# EAGLE design bbb_d300_breakout (EAGLE 7.7.0)

## Sheet 1 of 2
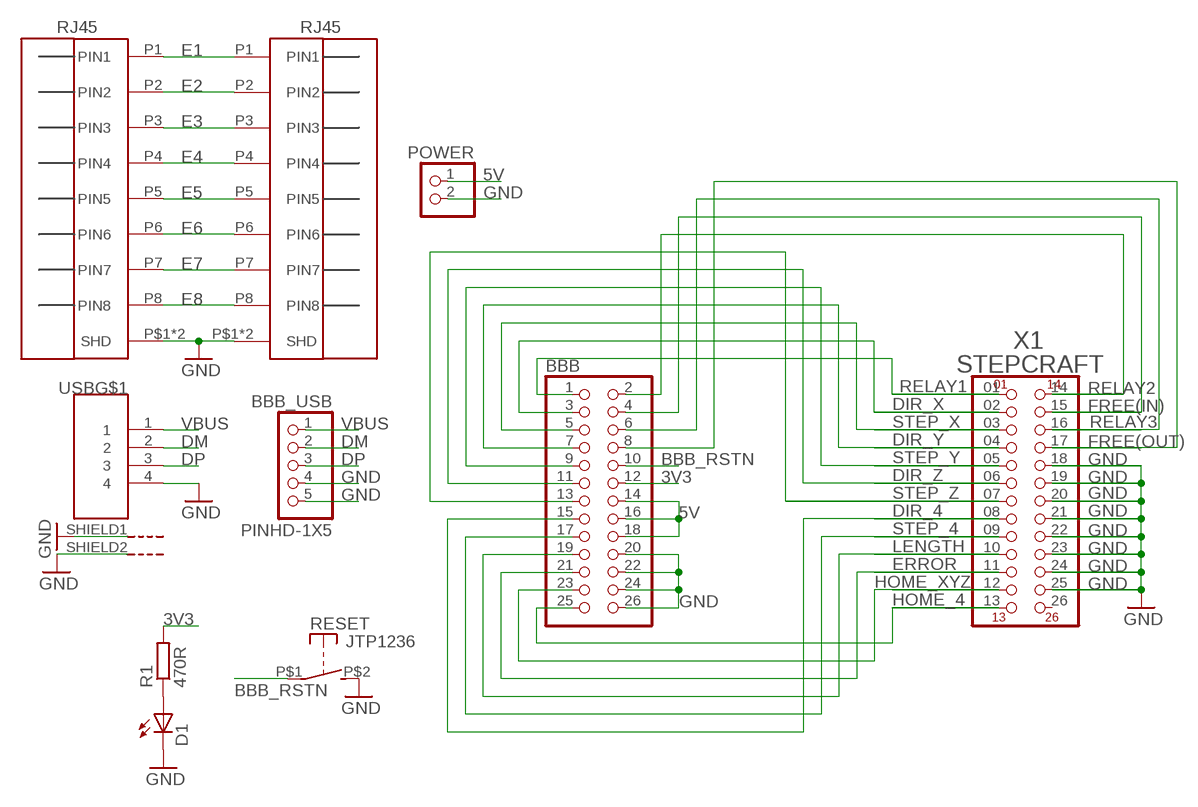
[diagram p0: schematic, sheet 1]

### Parts
BBB  PINHD-2X13  [2X13]
BBB_USB  PINHD-1X5  [1X05_XXL]
D1  LEDXXL  [LED3MM_XXL]
POWER  PINHD-1X2  [1X02]
R1  470R  R-EU_R0805  [R0805]
RESET  JTP1236  [JTP1236]
USB  USB_HOST  [USB]
X1  STEPCRAFT  PINHD-2X13_STEPCRAFT  [2X13_90_STEPCRAFT]
X2  RJ45  [RJ45]
X3  RJ45  [RJ45]

### Nets
3V3: BBB.12 R1.2
5V: BBB.14 BBB.16 BBB.18 POWER.1
BBB_RSTN: BBB.10 RESET.P$1(P)
DIR_4: BBB.15 X1.08
DIR_X: BBB.3 X1.02
DIR_Y: BBB.7 X1.04
DIR_Z: BBB.11 X1.06
DM: BBB_USB.2 USB.2
DP: BBB_USB.3 USB.3
E1: X2.P1(PIN1) X3.P1(PIN1)
E2: X2.P2(PIN2) X3.P2(PIN2)
E3: X2.P3(PIN3) X3.P3(PIN3)
E4: X2.P4(PIN4) X3.P4(PIN4)
E5: X2.P5(PIN5) X3.P5(PIN5)
E6: X2.P6(PIN6) X3.P6(PIN6)
E7: X2.P7(PIN7) X3.P7(PIN7)
E8: X2.P8(PIN8) X3.P8(PIN8)
ERROR: BBB.21 X1.11
FREE(IN): BBB.4 X1.15
FREE(OUT): BBB.8 X1.17
GND: BBB.20 BBB.22 BBB.24 BBB.26 BBB_USB.4 BBB_USB.5 D1.K(C) POWER.2 RESET.P$2(S) USB.4 USB.SHIELD1(G) USB.SHIELD2(G) X1.18 X1.19 X1.20 X1.21 X1.22 X1.23 X1.24 X1.25 X2.P$1(SHD) X2.P$2(SHD) X3.P$1(SHD) X3.P$2(SHD)
HOME_4: BBB.25 X1.13
HOME_XYZ: BBB.23 X1.12
LENGTH: BBB.19 X1.10
N$2: D1.A R1.1
RELAY1: BBB.1 X1.01
RELAY2: BBB.2 X1.14
RELAY3: BBB.6 X1.16
STEP_4: BBB.17 X1.09
STEP_X: BBB.5 X1.03
STEP_Y: BBB.9 X1.05
STEP_Z: BBB.13 X1.07
VBUS: BBB_USB.1 USB.1
Unconnected: X1.26

## Sheet 2 of 2
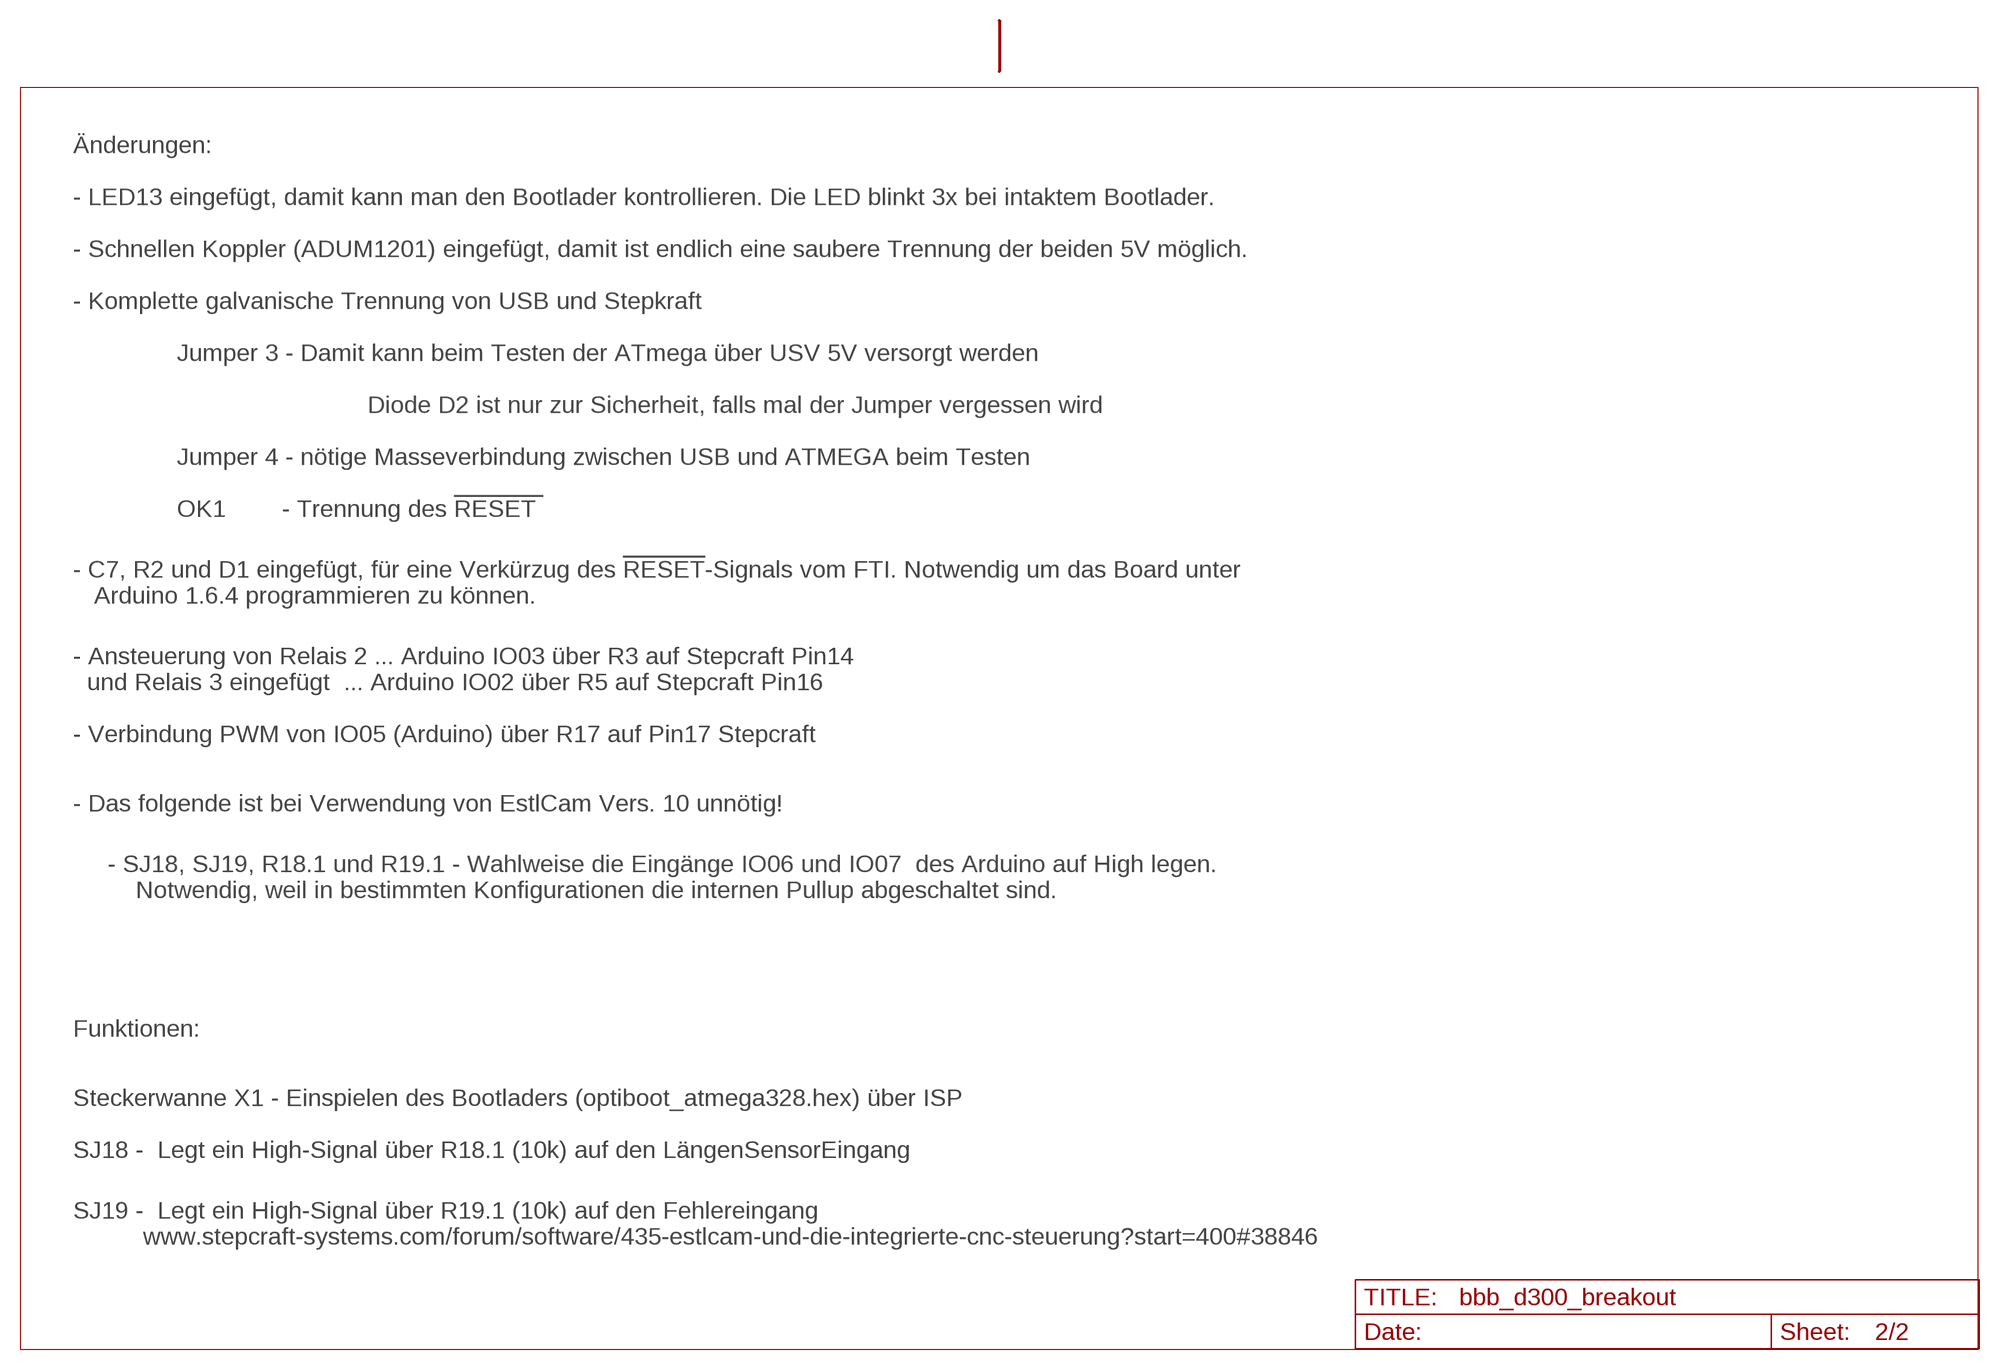
[diagram p1: schematic, sheet 2]

### Notes on the sheet
- Änderungen:
- - LED13 eingefügt, damit kann man den Bootlader kontrollieren. Die LED blinkt 3x bei intaktem Bootlader.
- - Schnellen Koppler (ADUM1201) eingefügt, damit ist endlich eine saubere Trennung der beiden 5V möglich.
- - Komplette galvanische Trennung von USB und Stepkraft
- Jumper 3 - Damit kann beim Testen der ATmega über USV 5V versorgt werden
- Diode D2 ist nur zur Sicherheit, falls mal der Jumper vergessen wird
- Jumper 4 - nötige Masseverbindung zwischen USB und ATMEGA beim Testen
- OK1        - Trennung des !RESET
- - C7, R2 und D1 eingefügt, für eine Verkürzug des !RESET!-Signals vom FTI. Notwendig um das Board unter 
     Arduino 1.6.4 programmieren zu können.
- - Ansteuerung von Relais 2 ... Arduino IO03 über R3 auf Stepcraft Pin14
    und Relais 3 eingefügt  ... Arduino IO02 über R5 auf Stepcraft Pin16
- - Verbindung PWM von IO05 (Arduino) über R17 auf Pin17 Stepcraft
- - Das folgende ist bei Verwendung von EstlCam Vers. 10 unnötig!
- - SJ18, SJ19, R18.1 und R19.1 - Wahlweise die Eingänge IO06 und IO07  des Arduino auf High legen.
      Notwendig, weil in bestimmten Konfigurationen die internen Pullup abgeschaltet sind.
- Funktionen:
- Steckerwanne X1 - Einspielen des Bootladers (optiboot_atmega328.hex) über ISP
- SJ18 -  Legt ein High-Signal über R18.1 (10k) auf den LängenSensorEingang
- SJ19 -  Legt ein High-Signal über R19.1 (10k) auf den Fehlereingang 
            www.stepcraft-systems.com/forum/software/435-estlcam-und-die-integrierte-cnc-steuerung?start=400#38846

## Library data of the parts
BBB = pinhead:PINHD-2X13: PIN HEADER
BBB_USB = 00vp:PINHD-1X5
D1 = 00vp:LED
POWER = pinhead:PINHD-1X2: PIN HEADER
R1 = 00_lcr:R-EU_: RESISTOR, European symbol
RESET = 00nikis:JTP1236
USB = 00nikis:USB_HOST: AMP connector
X1 = con-pinhead:PINHD-2X13_STEPCRAFT
X2 X3 = 00vp:RJ45

## Board
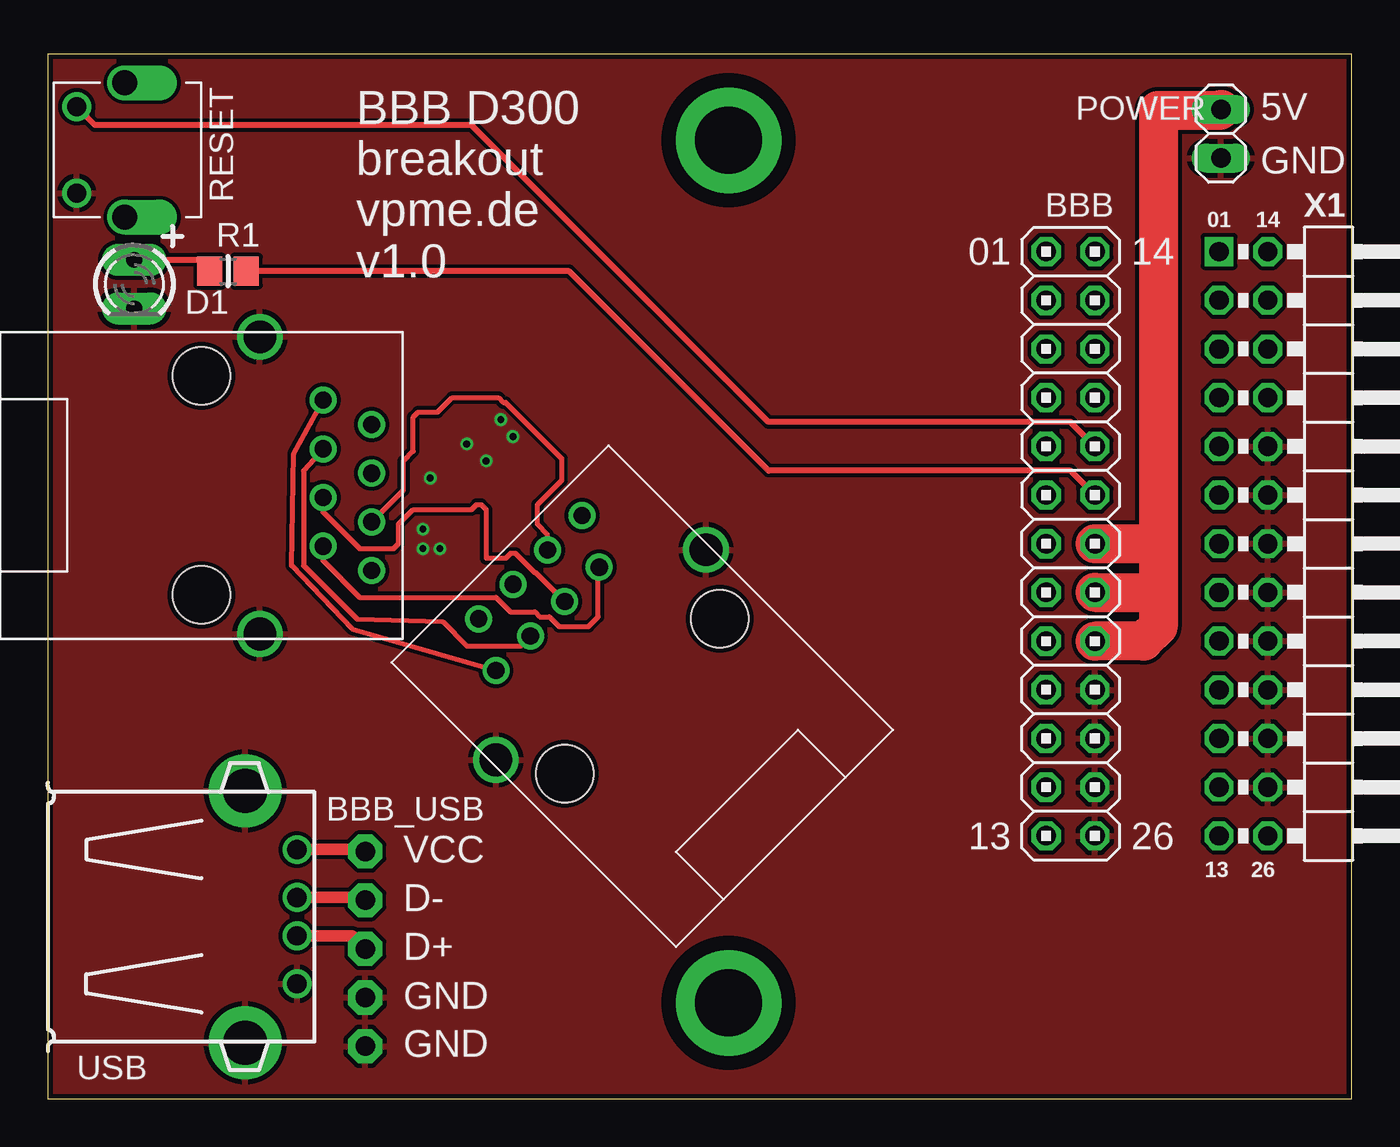
[diagram p2: board, top side]
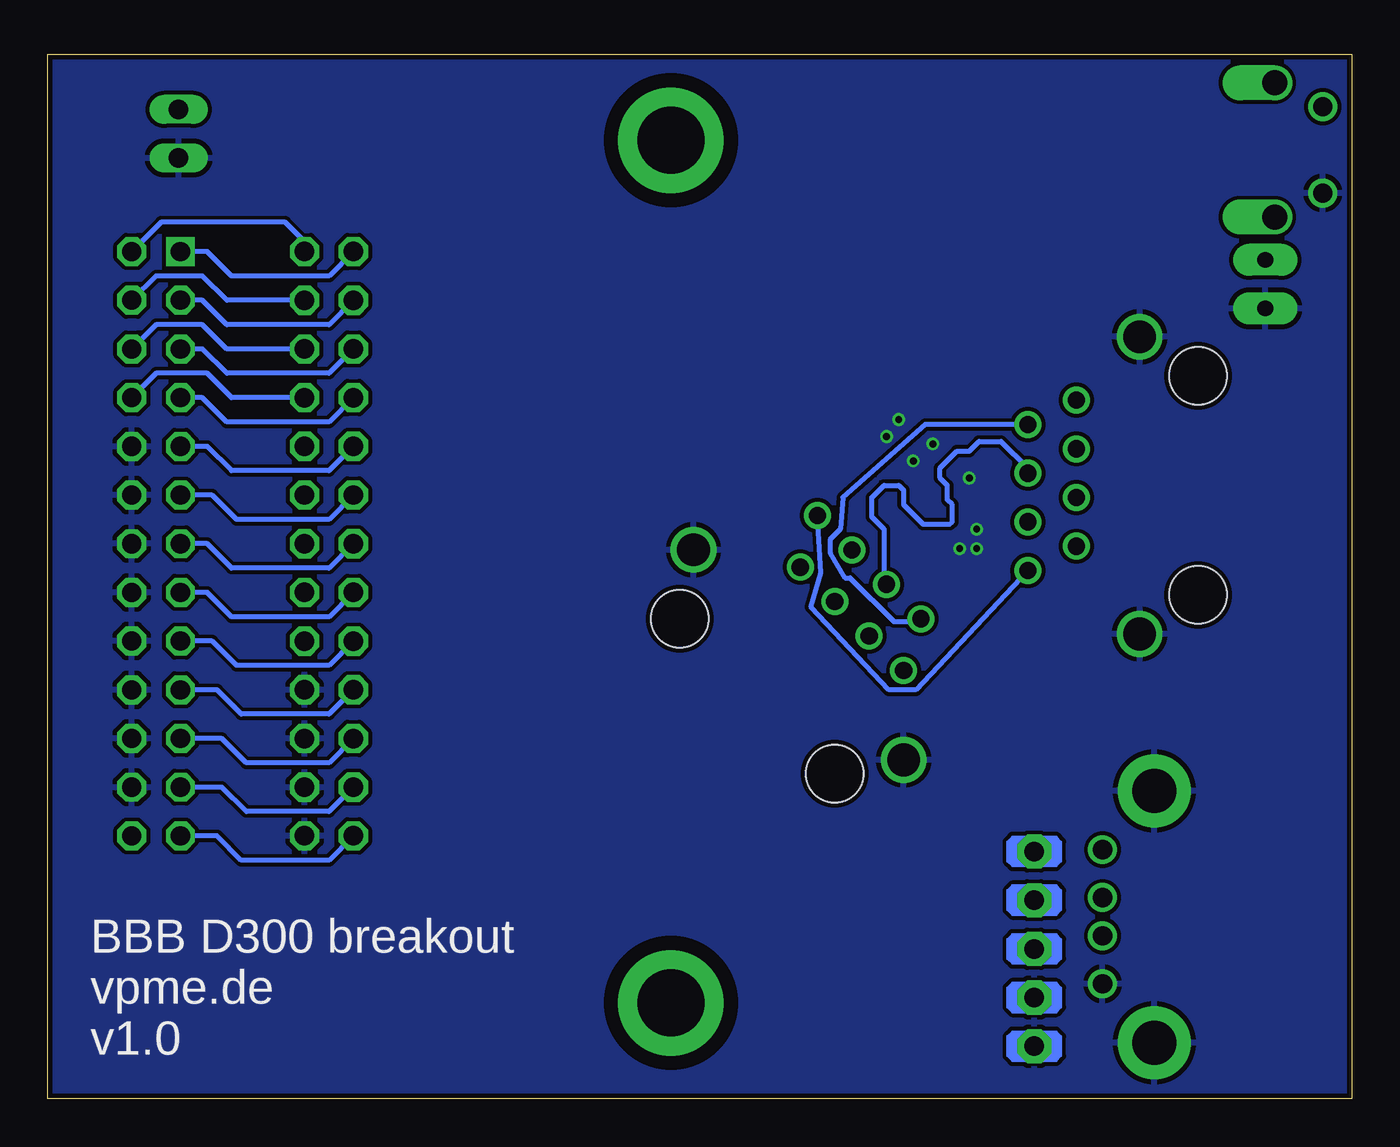
[diagram p3: board, bottom side, seen from below]

Size 68 x 54.5 mm. Coordinates in mm from the lower left corner, seen from the top.
Outline: 0,0 68,0 68,54.5 0,54.5 0,0
Copper layers (1*16): Top 0.035mm / dielectric 1.5mm / Bottom 0.035mm
Design rules "dirt_cheap_dirty_boards.v1": minimum track width 5mil, minimum drill 12mil, track to track 5mil, track to pad 5mil, pad to pad 5mil, via to via 5mil, smd to smd 0mil, copper to edge 10mil, drill to drill 10mil, minimum pad ring 10mil, minimum via ring 6mil, stop-mask expansion 2mil, vias tented up to drill 25mil, thermal gap 10mil
tRestrict: area 32.5,47 to 38.5,53; area 32.5,2 to 38.5,8
bRestrict: area 32.5,47 to 38.5,53; area 32.5,2 to 38.5,8

### Footprints (pad centres in the part's own frame; a part is rotated, then mirrored left to right if it is on the bottom)
2X13 = drill 1.016 octagon: 1 -15.24,-1.27; 2 -15.24,1.27; 3 -12.7,-1.27; 4 -12.7,1.27; 5 -10.16,-1.27; 6 -10.16,1.27; 7 -7.62,-1.27; 8 -7.62,1.27; 9 -5.08,-1.27; 10 -5.08,1.27; 11 -2.54,-1.27; 12 -2.54,1.27; 13 0,-1.27; 14 0,1.27; 15 2.54,-1.27; 16 2.54,1.27; 17 5.08,-1.27; 18 5.08,1.27; 19 7.62,-1.27; 20 7.62,1.27; 21 10.16,-1.27; 22 10.16,1.27; 23 12.7,-1.27; 24 12.7,1.27; 25 15.24,-1.27; 26 15.24,1.27
1X05_XXL = drill 1.016 pad 1.778 octagon: 1 -5.08,0; 2 -2.54,0; 3 0,0; 4 2.54,0; 5 5.08,0
LED3MM_XXL = drill 0.813 pad 1.676 long: A -1.27,0; K 1.27,0
1X02 = drill 1.016 long: 1 -1.27,0; 2 1.27,0
R0805 = smd 1.3 x 1.5: 1 -0.95,0; 2 0.95,0
JTP1236 = drill 1: P$1 -2.25,0; P$2 2.25,0 | drill 1.3 offset: P$3 -3.5,2.5; P$4 3.5,2.5
USB = drill 1: 1 -3.5,12.99; 2 -1,12.99; 3 1,12.99; 4 3.5,12.99 | drill 2.3 pad 3.81: SHIELD1 -6.57,10.28; SHIELD2 6.57,10.28
2X13_90_STEPCRAFT = drill 1 square: 01 -15.24,-1.27 | drill 1 octagon: 02 -12.7,-1.27; 03 -10.16,-1.27; 04 -7.62,-1.27; 05 -5.08,-1.27; 06 -2.54,-1.27; 07 0,-1.27; 08 2.54,-1.27; 09 5.08,-1.27; 10 7.62,-1.27; 11 10.16,-1.27; 12 12.7,-1.27; 13 15.24,-1.27; 14 -15.24,1.27; 15 -12.7,1.27; 16 -10.16,1.27; 17 -7.62,1.27; 18 -5.08,1.27; 19 -2.54,1.27; 20 0,1.27; 21 2.54,1.27; 22 5.08,1.27; 23 7.62,1.27; 24 10.16,1.27; 25 12.7,1.27; 26 15.24,1.27
RJ45 = drill 0.9: P1 6.35,4.445; P2 8.89,3.175; P3 6.35,1.905; P4 8.89,0.635; P5 6.35,-0.635; P6 8.89,-1.905; P7 6.35,-3.175; P8 8.89,-4.445 | drill 1.7: P$1 3.05,-7.75; P$2 3.05,7.75 | hole 3: 0,5.715; 0,-5.715

### Placement (x,y rotation side)
BBB  53.34,28.96 270 top
BBB_USB  16.55,7.82 270 top
D1  4.5,42.5 270 top
POWER  61.18,50.35 270 top
R1  9.4,43.17 0 top
RESET  1.5,49.5 270 top
USB  0,9.5 270 top
X1  62.36,28.96 270 top
X2  8,32 0 top
X3  31,21 135 top

### Tracks (layer width: path | path; a pad name or v marks a point on that pad's centre or on a via)
3V3
  Top 0.305: BBB.12 53.34,32.77 37.59,32.77 27.19,43.17 R1.2
5V
  Top 0.914: 57.66,26.42 57.91,26.67 | 57.66,28.96 57.91,29.21
  Top 2.032: BBB.18 57.15,23.88 57.91,24.64 57.91,26.67 57.91,29.21 57.91,51.56 61.13,51.56 POWER.1 | BBB.16 57.66,26.42 | BBB.14 57.66,28.96
BBB_RSTN
  Top 0.305: BBB.10 53.34,35.31 37.59,35.31 22.1,50.8 2.45,50.8 RESET.P$1
DIR_4
  Bottom 0.254: BBB.15 53.34,25.15 58.42,25.15 59.69,26.42 X1.08
DIR_X
  Bottom 0.254: BBB.3 53.34,40.39 58.67,40.39 59.94,41.66 X1.02
DIR_Y
  Bottom 0.254: BBB.7 53.34,35.31 58.67,35.31 59.94,36.58 X1.04
DIR_Z
  Bottom 0.254: BBB.11 53.34,30.23 58.17,30.23 59.44,31.5 X1.06
DM
  Top 0.61: USB.2 16.41,10.5 BBB_USB.2
DP
  Top 0.61: USB.3 15.87,8.5 BBB_USB.3
E1
  Top 0.254: X3.P1 15.88,24.51 12.7,27.81 12.83,33.66 X2.P1
E2
  Bottom 0.254: X2.P2 22.23,35.17 26.54,31.37 26.67,29.72 27.18,29.21 27.18,28.45 26.42,27.18 26.16,27.18 23.88,24.89 22.62,24.89 X3.P2
E3
  Top 0.254: X2.P3 13.34,32.76 13.34,27.81 16.13,25.02 20.57,24.89 21.84,23.62 24.64,23.62 X3.P3
E4
  Bottom 0.254: X2.P4 16.89,32.89 18.29,34.29 19.43,34.29 19.94,33.78 20.57,33.78 21.46,32.89 21.46,32.38 21.08,32 21.08,31.24 20.83,30.99 20.83,30.1 20.95,29.97 22.35,29.97 23.37,30.99 23.37,31.75 23.62,32 24.38,32 25.02,31.37 25.02,30.35 24.38,29.72 24.38,26.96 X3.P4
E5
  Top 0.254: X2.P5 14.35,30.61 16.26,28.7 18.03,28.7 18.29,28.96 18.29,29.97 19.05,30.73 22.1,30.73 22.35,30.99 22.61,30.99 22.86,30.73 22.86,28.19 23.88,28.19 24.13,28.45 24.38,28.45 25.4,27.43 25.47,27.43 X3.P5
E6
  Top 0.254: X2.P6 18.54,31.75 18.54,33.27 19.05,33.78 19.05,35.56 19.3,35.81 20.32,35.81 21.08,36.58 23.5,36.58 23.75,36.32 23.88,36.32 26.8,33.4 26.8,32.26 25.53,30.99 25.53,29.97 26.06,29.44 X3.P6
E7
  Top 0.254: X2.P7 14.35,28.07 16.26,26.16 23.37,26.16 24.13,25.4 25.4,25.4 25.65,25.15 26.16,25.15 26.67,24.64 28.19,24.64 28.7,25.15 28.7,27.68 X3.P7
E8
  Bottom 0.254: X2.P8 22.73,21.34 24.13,21.34 28.19,25.65 27.69,27.43 X3.P8
ERROR
  Bottom 0.254: BBB.21 53.34,17.53 57.66,17.53 58.93,18.8 X1.11
FREE(IN)
  Bottom 0.254: BBB.4 58.67,41.66 59.94,42.93 62.36,42.93 X1.15
FREE(OUT)
  Bottom 0.254: BBB.8 58.42,36.58 59.69,37.85 62.36,37.85 X1.17
GND  (via drill 0.36)
  other vias: 23.62,35.43 24.26,34.54 21.84,34.16 22.86,33.27 19.94,32.38 19.56,29.72 19.56,28.7 20.45,28.7
  pour Top (isolate 0.203, rank 3): 0,0 68.01,0 68.01,54.48 0,54.48
  pour Bottom (isolate 0.203, rank 3): 0,0 68.01,0 68.01,54.48 0,54.48
HOME_4
  Bottom 0.254: BBB.25 53.34,12.45 57.91,12.45 59.18,13.72 X1.13
HOME_XYZ
  Bottom 0.254: BBB.23 53.34,14.99 57.66,14.99 58.93,16.26 X1.12
LENGTH
  Bottom 0.254: BBB.19 53.34,20.07 57.91,20.07 59.18,21.34 X1.10
N$2
  Top 0.305: D1.A 7.82,43.77 R1.1
N$9  (via drill 3.5 pad 5.5)
  other vias: 35.5,5
N$11  (via drill 3.5 pad 5.5)
  other vias: 35.5,50
RELAY1
  Bottom 0.254: BBB.1 53.34,42.93 58.42,42.93 59.69,44.2 X1.01
RELAY2
  Bottom 0.254: BBB.2 54.61,44.7 55.63,45.72 62.1,45.72 X1.14
RELAY3
  Bottom 0.254: BBB.6 58.67,39.12 59.94,40.39 62.36,40.39 X1.16
STEP_4
  Bottom 0.254: BBB.17 53.34,22.61 58.17,22.61 59.44,23.88 X1.09
STEP_X
  Bottom 0.254: BBB.5 53.34,37.85 58.67,37.85 59.94,39.12 X1.03
STEP_Y
  Bottom 0.254: BBB.9 53.34,32.77 58.42,32.77 59.69,34.04 X1.05
STEP_Z
  Bottom 0.254: BBB.13 53.34,27.69 58.42,27.69 59.69,28.96 X1.07
VBUS
  Top 0.61: USB.1 16.45,13 BBB_USB.1

### Text on the board
tPlace: 5V | GND | 01 | 14 | BBB D300 / breakout / vpme.de / v1.0 | 13 | 26 | VCC | D- | D+ | GND | GND
bPlace: BBB D300 breakout / vpme.de / v1.0